# EAGLE design SMDv2 (EAGLE 7.4.0)
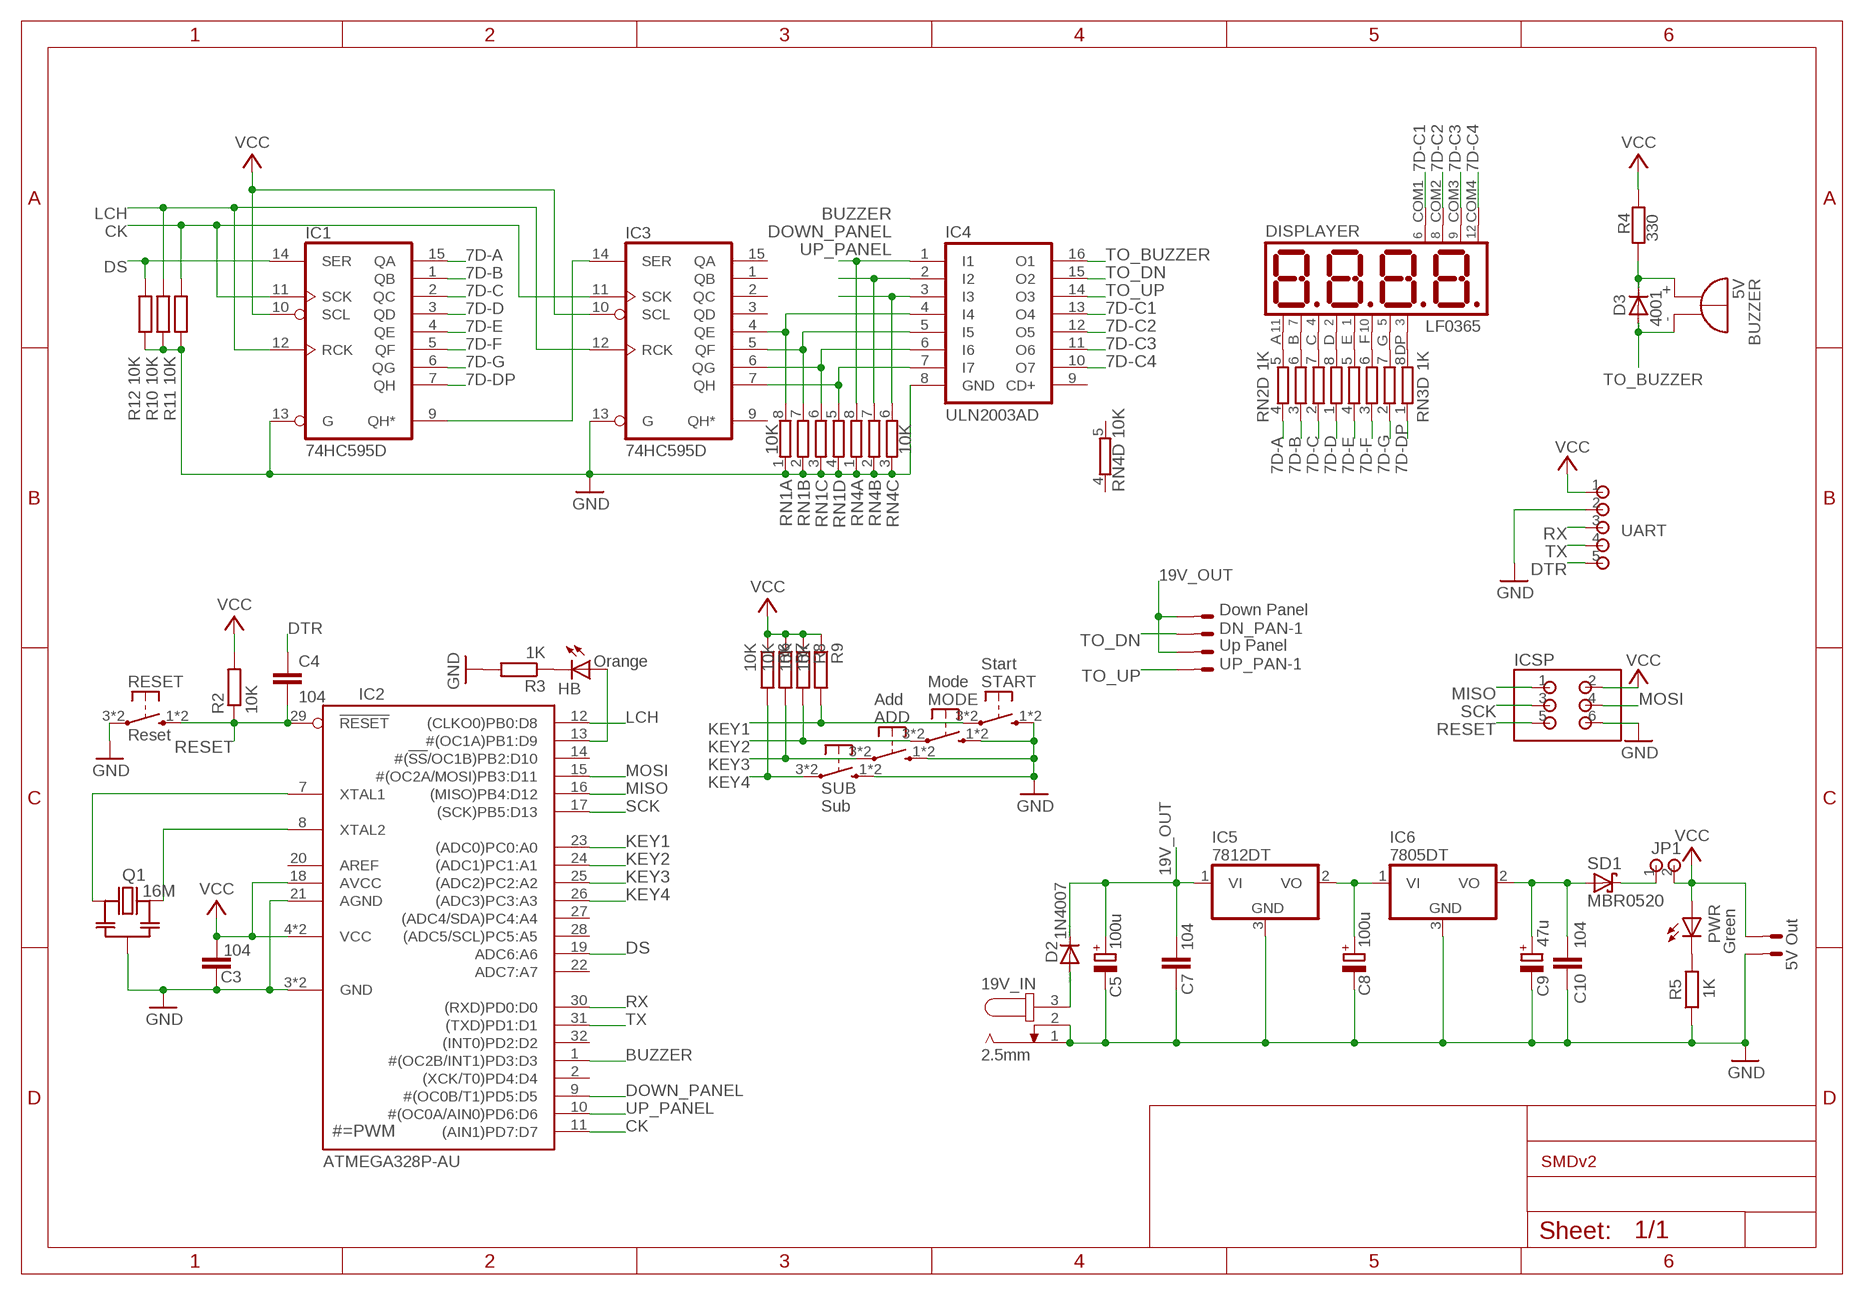
[diagram p0: schematic, sheet 1]

## Parts
5V_OUT  5V Out  L02P  [L02P]
19V_IN  2.5mm  DC-JACK/2.5MM  [SPC4078]
ADD  Add  SW-PUSH/6*6*3.8MM  [SW-6*6*3.8MM]
BUZZER  5V  BZ-5V  [BZ-5V]
C3  104  C-EUC0805  [C0805]
C4  104  C-EUC0805  [C0805]
C5  100u  CPOL-EU140CLH-0810  [140CLH-0810]
C7  104  C-EUC0805  [C0805]
C8  100u  CPOL-EUSMCC  [SMC_C]
C9  47u  CPOL-EUSMCC  [SMC_C]
C10  104  C-EUC0805  [C0805]
D2  1N4007  DIODE-DO-214AC  [DO-214AC]
D3  4001  DIODE-DO-214AC  [DO-214AC]
DISPLAYER  LF0365  [LF036*]
DN_PAN  Down Panel  L02P  [L02P]
HB  Orange  LEDCHIPLED_1206  [CHIPLED_1206]
IC1  74HC595D  [SO16]
IC2  ATMEGA328P-AU  [TQFP32]
IC3  74HC595D  [SO16]
IC4  ULN2003AD  [SO16]
IC5  7812DT  [TO252]
IC6  7805DT  [TO252]
ICSP  PIN-2X3/DIP  [DIP-2.54-2X3]
JP1  PIN-1X2-2.54  [DIP-2.54-1X2]
MODE  Mode  SW-PUSH/6*6*3.8MM  [SW-6*6*3.8MM]
PWR  Green  LEDCHIPLED_1206  [CHIPLED_1206]
Q1  16M  CERMOSCILL-CSTCE  [CSTCE]
R2  10K  R-EU_R0805  [R0805]
R3  1K  R-EU_R0805  [R0805]
R4  330  R-EU_R0805  [R0805]
R5  1K  R-EU_R0805  [R0805]
R6  10K  R-EU_R0805  [R0805]
R7  10K  R-EU_R0805  [R0805]
R8  10K  R-EU_R0805  [R0805]
R9  10K  R-EU_R0805  [R0805]
R10  10K  R-EU_R0805  [R0805]
R11  10K  R-EU_R0805  [R0805]
R12  10K  R-EU_R0805  [R0805]
RESET  Reset  SW-PUSH/4*4*3.8MM  [SW-4*4*3.8MM]
RN1  10K  RN4R-CAY16  [CAY16]
RN2  1K  RN4R-CAY16  [CAY16]
RN3  1K  RN4R-CAY16  [CAY16]
RN4  10K  RN4R-CAY16  [CAY16]
SD1  MBR0520  SCHOTTKY  [SOD123]
START  Start  SW-PUSH/6*6*3.8MM  [SW-6*6*3.8MM]
SUB  Sub  SW-PUSH/6*6*3.8MM  [SW-6*6*3.8MM]
UART  PIN-1X5-2.54  [DIP-2.54-1X5]
UP_PAN  Up Panel  L02P  [L02P]

## Nets
7D-A: IC1.15(QA) RN2.4
7D-B: IC1.1(QB) RN2.3
7D-C: IC1.2(QC) RN2.2
7D-C1: DISPLAYER.COM1 IC4.13(O4)
7D-C2: DISPLAYER.COM2 IC4.12(O5)
7D-C3: DISPLAYER.COM3 IC4.11(O6)
7D-C4: DISPLAYER.COM4 IC4.10(O7)
7D-D: IC1.3(QD) RN2.1
7D-DP: IC1.7(QH) RN3.1
7D-E: IC1.4(QE) RN3.4
7D-F: IC1.5(QF) RN3.3
7D-G: IC1.6(QG) RN3.2
12V: C8.+ IC5.2(VO) IC6.1(VI)
19V_OUT: C5.+ C7.1 D2.C DN_PAN.2 IC5.1(VI) UP_PAN.2
BUZZER: IC2.1(#(OC2B/INT1)PD3:D3) IC4.1(I1) RN4.8
CK: IC1.11(SCK) IC2.11((AIN1)PD7:D7) IC3.11(SCK) R11.2
DOWN_PANEL: IC2.9(#(OC0B/T1)PD5:D5) IC4.2(I2) RN4.7
DS: IC1.14(SER) IC2.19(ADC6:A6) R12.2
DTR: C4.1 UART.5
GND: 5V_OUT.1 19V_IN.1 19V_IN.2 ADD.1(S) ADD.2(S) C3.1 C5.- C7.2 C8.- C9.- C10.2 IC1.13(G) IC2.3(GND) IC2.5(GND) IC2.21(AGND) IC3.13(G) IC4.8(GND) IC5.3(GND) IC6.3(GND) ICSP.6 MODE.1(S) MODE.2(S) Q1.2(GND) R3.2 R5.1 R10.1 R11.1 R12.1 RESET.3(P) RESET.4(P) RN1.1 RN1.2 RN1.3 RN1.4 RN4.1 RN4.2 RN4.3 START.1(S) START.2(S) SUB.1(S) SUB.2(S) UART.2
KEY1: IC2.23((ADC0)PC0:A0) R9.2 START.3(P) START.4(P)
KEY2: IC2.24((ADC1)PC1:A1) MODE.3(P) MODE.4(P) R8.2
KEY3: ADD.3(P) ADD.4(P) IC2.25((ADC2)PC2:A2) R7.2
KEY4: IC2.26((ADC3)PC3:A3) R6.2 SUB.3(P) SUB.4(P)
LCH: IC1.12(RCK) IC2.12((CLKO0)PB0:D8) IC3.12(RCK) R10.2
MISO: IC2.16((MISO)PB4:D12) ICSP.1
MOSI: IC2.15(#(OC2A/MOSI)PB3:D11) ICSP.4
N$1: 19V_IN.3 D2.A
N$3: C9.+ C10.1 IC6.2(VO) SD1.A
N$4: JP1.1 SD1.K
N$5: HB.C R3.1
N$7: DISPLAYER.A RN2.5
N$8: IC3.4(QE) IC4.4(I4) RN1.8
N$9: IC2.7(XTAL1) Q1.1(IN)
N$10: PWR.C R5.2
N$11: IC1.9(QH*) IC3.14(SER)
N$12: IC3.5(QF) IC4.5(I5) RN1.7
N$13: DISPLAYER.B RN2.6
N$14: IC3.6(QG) IC4.6(I6) RN1.6
N$15: IC3.7(QH) IC4.7(I7) RN1.5
N$18: BUZZER.+ D3.C R4.1
N$19: DISPLAYER.C RN2.7
N$20: DISPLAYER.D RN2.8
N$21: DISPLAYER.E RN3.5
N$22: DISPLAYER.F RN3.6
N$23: DISPLAYER.G RN3.7
N$24: DISPLAYER.DP RN3.8
N$28: HB.A IC2.13(#(OC1A)PB1:D9)
N$61: IC2.8(XTAL2) Q1.3(OUT)
RESET: C4.2 IC2.29(!RESET) ICSP.5 R2.1 RESET.1(S) RESET.2(S)
RX: IC2.30((RXD)PD0:D0) UART.3
SCK: IC2.17((SCK)PB5:D13) ICSP.3
TO_BUZZER: BUZZER.- D3.A IC4.16(O1)
TO_DN: DN_PAN.1 IC4.15(O2)
TO_UP: IC4.14(O3) UP_PAN.1
TX: IC2.31((TXD)PD1:D1) UART.4
UP_PANEL: IC2.10(#(OC0A/AIN0)PD6:D6) IC4.3(I3) RN4.6
VCC: 5V_OUT.2 C3.2 IC1.10(SCL) IC2.4(VCC) IC2.6(VCC) IC2.18(AVCC) IC3.10(SCL) ICSP.2 JP1.2 PWR.A R2.2 R4.2 R6.1 R7.1 R8.1 R9.1 UART.1
Unconnected: IC2.2((XCK/T0)PD4:D4) IC2.14(#(!SS!/OC1B)PB2:D10) IC2.20(AREF) IC2.22(ADC7:A7) IC2.27((ADC4/SDA)PC4:A4) IC2.28((ADC5/SCL)PC5:A5) IC2.32((INT0)PD2:D2) IC3.1(QB) IC3.2(QC) IC3.3(QD) IC3.9(QH*) IC3.15(QA) IC4.9(CD+) RN4.4 RN4.5

## Power pins joined to a net without a drawn wire
GND: IC1.8(GND) IC3.8(GND)
VCC: IC1.16(VCC) IC3.16(VCC)

## Library data of the parts
5V_OUT DN_PAN UP_PAN = con-amp-mt:L02P: AMP MT CONNECTOR; OC_FARNELL: unknown; OC_NEWARK: unknown
19V_IN = 0_MyCustom:DC-JACK: DC 電源插座 Power Jack, DC, Right Angle, Through Hole, Rated 5A at 16VDC, PC Terminals Distributor: Farnell (www.Farnell.de) Drawing: 84N1161.pdf / 84N1162.pdf Manufacturer: SPC Technology (www.spctechnology.com) Type: SPC4077(2mm) / SPC 4078(2.5mm)
ADD MODE RESET START SUB = 0_MyCustom:SW-PUSH: 無段式開關
BUZZER = 0_MyCustom:BZ-5V: 5V 直流蜂鳴器 ZEETEK 1205
C3 C4 C7 C10 = rcl:C-EU: CAPACITOR, European symbol
C5 C8 C9 = rcl:CPOL-EU: POLARIZED CAPACITOR, European symbol
D2 D3 = diode:DIODE-: DIODE
DISPLAYER = 0_MyCustom:LF0365: LF0365xWK 共陰
HB PWR = led:LED: LED OSRAM: - CHIPLED LG R971, LG N971, LY N971, LG Q971, LY Q971, LO R971, LY R971 LH N974, LH R974 LS Q976, LO Q976, LY Q976 LO Q996 - Hyper CHIPLED LW Q18S LB Q993, LB Q99A, LB R99A - SideLED LS A670, LO A670, LY A670, LG A670, LP A670 LB A673, LV A673, LT A673, LW A673 LH A674 LY A675 LS A676, LA A676, LO A676, LY A676, LW A676 LS A679, LY A679, LG A679 - Hyper Micro SIDELED® LS Y876, LA Y876, LO Y876, LY Y876 LT Y87S - SmartLED LW L88C, LW L88S LB L89C, LB L89S, LG L890 LS L89K, LO L89K, LY L89K LS L896, LA L896, LO L896, LY L896 - TOPLED LS T670, LO T670, LY T670, LG T670, LP T670 LSG T670, LSP T670, LSY T670, LOP T670, LYG T670 LG T671, LOG T671, LSG T671 LB T673, LV T673, LT T673, LW T673 LH T674 LS T676, LA T676, LO T676, LY T676, LB T676, LH T676, LSB T676, LW T676 LB T67C, LV T67C, LT T67C, LS T67K, LO T67K, LY T67K, LW E67C LS E67B, LA E67B, LO E67B, LY E67B, LB E67C, LV E67C, LT E67C LW T67C LS T679, LY T679, LG T679 LS T770, LO T770, LY T770, LG T770, LP T770 LB T773, LV T773, LT T773, LW T773 LH T774 LS E675, LA E675, LY E675, LS T675 LS T776, LA T776, LO T776, LY T776, LB T776 LHGB T686 LT T68C, LB T68C - Hyper Mini TOPLED® LB M676 - Mini TOPLED Santana® LG M470 LS M47K, LO M47K, LY M47K Source: http://www.osram.convergy.de LUXEON: - LUMILED® LXK2-PW12-R00, LXK2-PW12-S00, LXK2-PW14-U00, LXK2-PW14-V00 LXK2-PM12-R00, LXK2-PM12-S00, LXK2-PM14-U00 LXK2-PE12-Q00, LXK2-PE12-R00, LXK2-PE12-S00, LXK2-PE14-T00, LXK2-PE14-U00 LXK2-PB12-K00, LXK2-PB12-L00, LXK2-PB12-M00, LXK2-PB14-N00, LXK2-PB14-P00, LXK2-PB14-Q00 LXK2-PR12-L00, LXK2-PR12-M00, LXK2-PR14-Q00, LXK2-PR14-R00 LXK2-PD12-Q00, LXK2-PD12-R00, LXK2-PD12-S00 LXK2-PH12-R00, LXK2-PH12-S00 LXK2-PL12-P00, LXK2-PL12-Q00, LXK2-PL12-R00 Source: www.luxeon.com KINGBRIGHT: KA-3528ASYC Source: www.kingbright.com
IC1 IC3 = 74xx-eu:74*595: 8-bit SHIFT REGISTER, output latch
IC2 = 0_MyCustom:ATMEGA328P-AU: ATMEGA328P-AU
IC4 = uln-udn:ULN2003A: DRIVER ARRAY
IC5 IC6 = linear:78*: Positive VOLTAGE REGULATOR Source: http://cache.national.com/ds/LM/LM78L05.pdf http://www.fairchildsemi.com/ds/LM/LM7805.pdf
ICSP = 0_MyCustom:PIN-2X3
JP1 = 0_MyCustom:PIN-1X2
Q1 = 0_MyCustom:CERMOSCILL
R2-R12 = rcl:R-EU_: RESISTOR, European symbol
RN1-RN4 = 0_MyCustom:RN4R: B型排阻 8P4R
SD1 = 0_MyCustom:SCHOTTKY
UART = 0_MyCustom:PIN-1X5

## Net classes
0 default: clearance 0.205 mm

## Board
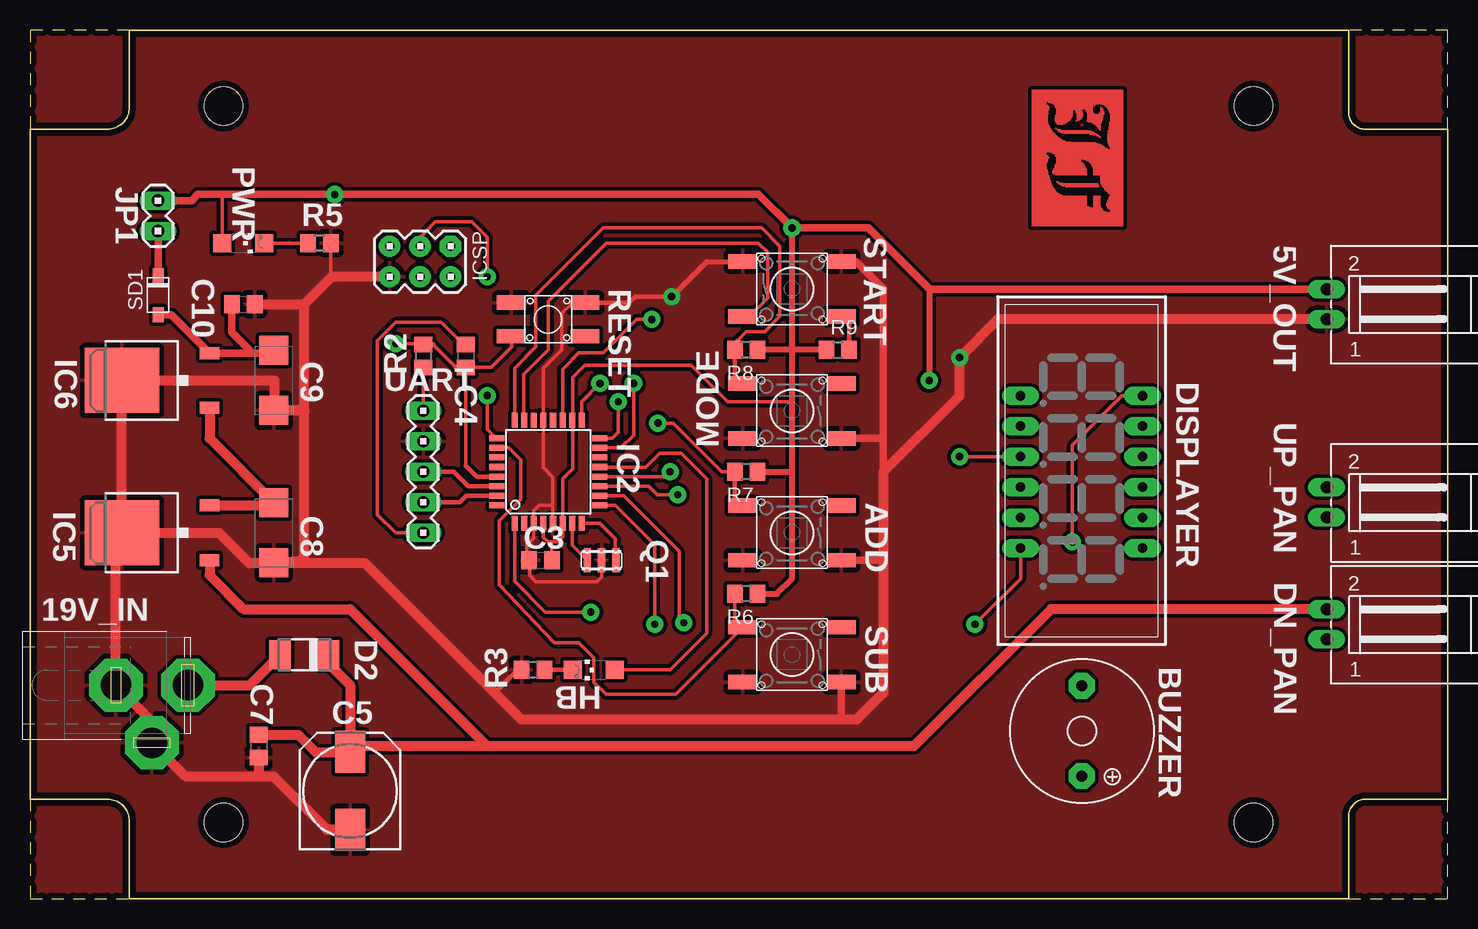
[diagram p1: board, top side]
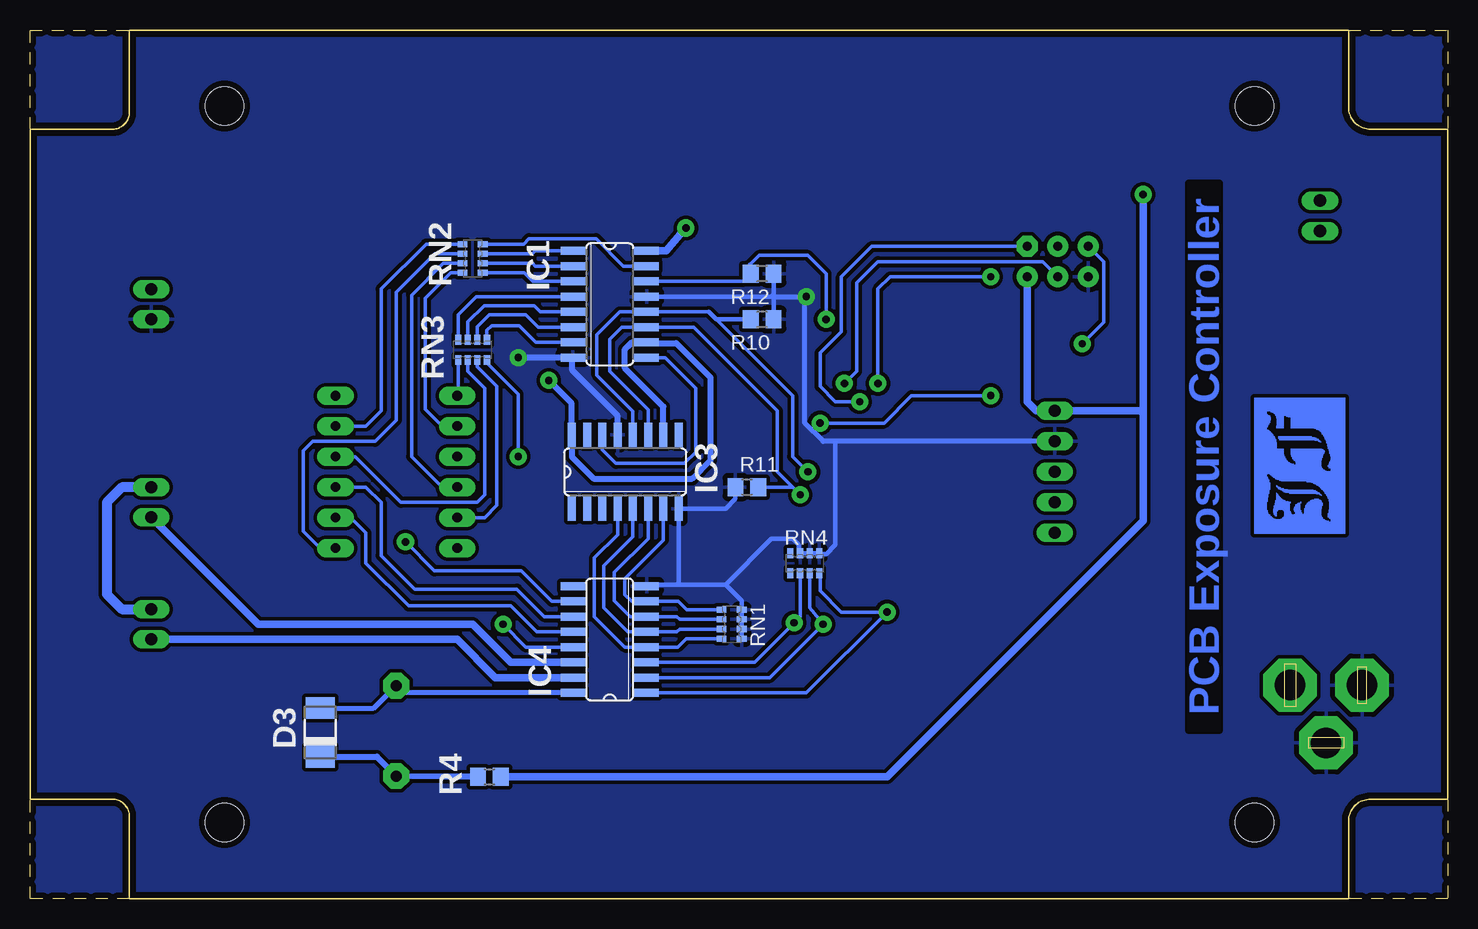
[diagram p2: board, bottom side, seen from below]

Size 118.16 x 72.38 mm. Coordinates in mm from the lower left corner, seen from the top.
Copper layers (1*16): Top 0.035mm / dielectric 1.5mm / Bottom 0.035mm
Design rules "SMD-Orig *": minimum track width 10mil, minimum drill 12mil, track to track 8mil, track to pad 8mil, pad to pad 8mil, via to via 8mil, smd to smd 8mil, copper to edge 20mil, drill to drill 8mil, minimum pad ring 10mil, minimum via ring 8mil, stop-mask expansion 4mil, vias tented up to drill 0mil, thermal gap 16mil
tKeepout: area 81.7,8 to 93.6,19.9; area 89.5,10.1 to 90.9,11.5; 157 lines
bKeepout: 59 lines

### Footprints (pad centres in the part's own frame; a part is rotated, then mirrored left to right if it is on the bottom)
L02P = drill 1.016 long: 1 1.25,-6.25; 2 -1.25,-6.25
SPC4078 = drill 2.54 pad 4.445 octagon: 1 -3,0; 2 0,-4.8; 3 3,0
SW-6*6*3.8MM = smd 2.4 x 1.2: 1 -4.109,2.286; 2 4.109,2.286; 3 -4.109,-2.286; 4 4.109,-2.286
BZ-5V = drill 0.914 pad 2.159 octagon: + 3.759,0; - -3.759,0
C0805 = smd 1.3 x 1.5: 1 -0.95,0; 2 0.95,0
140CLH-0810 = smd 3.5 x 2.5: + 3.25,0; - -3.25,0
SMC_C = smd 2.4 x 2.4: + -2.5,0; - 2.5,0
DO-214AC = smd 1.8 x 2.4: A 2.025,0; C -2.025,0
LF036* = drill 0.813 pad 1.524 long: A -3.175,5.08; B 6.985,5.08; C 1.905,-5.08; COM1 6.985,-5.08; COM2 4.445,5.08; COM3 1.905,5.08; COM4 -5.715,5.08; D -3.175,-5.08; DP -0.635,-5.08; E -5.715,-5.08; F -0.635,5.08; G 4.445,-5.08
CHIPLED_1206 = smd 1.5 x 1.5: A 0,-1.75; C 0,1.75
SO16 = smd 0.66 x 2.032: 1 -4.445,-3.073; 2 -3.175,-3.073; 3 -1.905,-3.073; 4 -0.635,-3.073; 5 0.635,-3.073; 6 1.905,-3.073; 7 3.175,-3.073; 8 4.445,-3.073; 9 4.445,3.073; 10 3.175,3.073; 11 1.905,3.073; 12 0.635,3.073; 13 -0.635,3.073; 14 -1.905,3.073; 15 -3.175,3.073; 16 -4.445,3.073
TQFP32 = smd 1.27 x 0.508: 1 -4.293,2.8; 2 -4.293,2; 3 -4.293,1.2; 4 -4.293,0.4; 5 -4.293,-0.4; 6 -4.293,-1.2; 7 -4.293,-2; 8 -4.293,-2.8; 17 4.293,-2.8; 18 4.293,-2; 19 4.293,-1.2; 20 4.293,-0.4; 21 4.293,0.4; 22 4.293,1.2; 23 4.293,2; 24 4.293,2.8 | smd 0.508 x 1.27: 9 -2.8,-4.293; 10 -2,-4.293; 11 -1.2,-4.293; 12 -0.4,-4.293; 13 0.4,-4.293; 14 1.2,-4.293; 15 2,-4.293; 16 2.8,-4.293; 25 2.8,4.293; 26 2,4.293; 27 1.2,4.293; 28 0.4,4.293; 29 -0.4,4.293; 30 -1.2,4.293; 31 -2,4.293; 32 -2.8,4.293
TO252 = smd 1 x 1.6: 1 -2.28,-4.8; 2 2.28,-4.8 | smd 5.4 x 6.2: 3 0,2.5
DIP-2.54-2X3 = drill 0.762 pad 1.778 octagon: 1 -1.27,2.54 | drill 0.762 pad 1.778: 2 1.27,2.54; 3 -1.27,0; 4 1.27,0; 5 -1.27,-2.54; 6 1.27,-2.54
DIP-2.54-1X2 = drill 1.016 long: 1 -1.27,0; 2 1.27,0
CSTCE = smd 0.6 x 2: 1 -1.2,0; 2 0,0; 3 1.2,0
R0805 = smd 1.3 x 1.5: 1 -0.95,0; 2 0.95,0
SW-4*4*3.8MM = smd 2.4 x 1.2: 1 -3.076,1.4; 2 3.076,1.4; 3 3.076,-1.4; 4 -3.076,-1.4
CAY16 = smd 0.508 x 0.813: 1 -1.2,-0.838; 2 -0.4,-0.838; 3 0.4,-0.838; 4 1.2,-0.838; 5 1.2,0.838; 6 0.4,0.838; 7 -0.4,0.838; 8 -1.2,0.838
SOD123 = smd 1.219 x 0.914: A -1.638,0; K 1.638,0
CASE-1 = hole 3.2: 16.129,6.35; 101.956,6.35; 101.956,66.03; 16.129,66.03
DIP-2.54-1X5 = drill 1.016 long: 1 -5.08,0; 2 -2.54,0; 3 0,0; 4 2.54,0; 5 5.08,0

### Placement (x,y rotation side)
5V_OUT  114.3,49.53 270 top
19V_IN  10.16,17.78 0 top
ADD  63.5,30.48 180 top
BUZZER  87.66,13.97 270 top
C3  42.55,28.19 0 top
C4  36.32,45.21 270 top
C5  26.67,8.98 90 top
C7  19.05,12.7 270 top
C8  20.32,30.48 270 top
C9  20.32,43.18 270 top
C10  17.78,49.53 0 top
D2  22.86,20.32 180 top
D3  93.98,13.84 90 bottom
DISPLAYER  87.63,36.2 270 top
DN_PAN  114.3,22.86 270 top
HB  46.99,19.05 90 top
IC1  69.85,49.53 270 bottom
IC2  43.18,35.56 90 top
IC3  68.55,35.56 0 bottom
IC4  69.85,21.59 90 bottom
IC5  10.16,30.48 90 top
IC6  10.16,43.18 90 top
ICSP  32.51,53.09 270 top
JP1  10.67,56.9 90 top
MODE  63.5,40.64 180 top
PWR  17.78,54.61 270 top
Q1  47.62,28.19 0 top
R2  32.77,45.21 270 top
R3  41.91,19.05 180 top
R4  79.88,10.16 0 bottom
R5  24.13,54.61 180 top
R6  59.69,25.4 180 top
R7  59.69,35.56 180 top
R8  59.69,45.72 180 top
R9  67.31,45.72 0 top
R10  57.15,48.26 180 bottom
R11  58.42,34.29 0 bottom
R12  57.15,52.07 180 bottom
RESET  43.18,48.26 180 top
RN1  59.69,22.86 90 bottom
RN2  81.28,53.34 90 bottom
RN3  81.28,45.72 180 bottom
RN4  53.59,27.94 180 bottom
SD1  10.67,50.29 90 top
START  63.5,50.8 0 top
SUB  63.5,20.32 180 top
U$1  [CASE-1]  0,0 0 top
UART  32.77,35.56 270 top
UP_PAN  114.3,33.02 270 top

### Tracks (layer width: path | path; a pad name or v marks a point on that pad's centre or on a via)
7D-A
  Bottom 0.305: RN2.4 77.03,54.54 76.58,54.99 70.99,54.99 68.71,52.7 IC1.15
7D-B
  Bottom 0.305: RN2.3 76.31,53.74 76.07,53.98 IC1.1
7D-C
  Bottom 0.305: RN2.2 76.28,52.94 76.07,52.7 IC1.2
7D-C1  (via drill 0.61 pad 1.42)
  Top 0.305: DISPLAYER.COM1 82.55,26.67 v78.74,22.86
  Bottom 0.305: IC4.13 76.83,20.95 v78.74,22.86
7D-C2
  Bottom 0.305: DISPLAYER.COM2 91.44,31.75 90.17,30.48 90.17,27.94 86.61,24.38 78.11,24.38 75.95,22.23 IC4.12
7D-C3
  Bottom 0.305: DISPLAYER.COM3 90.17,34.29 88.9,33.02 88.9,28.57 86.11,25.78 77.6,25.78 75.31,23.5 IC4.11
7D-C4  (via drill 0.61 pad 1.42)
  Top 0.305: v86.87,29.72 86.87,37.78 91,41.91 DISPLAYER.COM4
  Bottom 0.305: IC4.10 74.68,24.77 77.22,27.3 84.45,27.3 v86.87,29.72
7D-D
  Bottom 0.305: RN2.1 76.96,52.14 76.26,51.44 IC1.3
7D-DP
  Bottom 0.305: RN3.1 80.08,47.36 79.69,47.75 77.41,47.75 76.01,46.35 IC1.7
7D-E
  Bottom 0.305: RN3.4 82.48,48.65 80.96,50.16 IC1.4
7D-F
  Bottom 0.305: RN3.3 81.68,48.05 80.33,49.4 76.14,49.4 75.63,48.9 IC1.5
7D-G
  Bottom 0.305: RN3.2 80.88,47.64 79.88,48.64 76.83,48.64 75.82,47.62 IC1.6
12V
  Top 0.508: 20.1,32.76 C8.+
  Top 0.813: IC5.2 20.1,32.76 | IC6.1 14.96,38.34 C8.+
19V_OUT
  Top 0.61: 108.03,24.13 DN_PAN.2
  Top 0.813: IC5.1 14.96,26.95 17.78,24.13 26.67,24.13 38.1,12.7 | 26.76,12.14 C5.+ | D2.C 24.89,19.57 26.67,17.78 26.67,12.7 | 26.67,12.7 C5.+ | C7.1 22.36,13.65 23.81,12.19 26.64,12.19 C5.+ | 108.03,24.13 85.09,24.13 73.66,12.7 38.1,12.7 | 38.1,12.7 26.67,12.7
  Bottom 0.813: UP_PAN.2 110.51,34.27 111.76,33.02 111.76,25.36 110.51,24.11 DN_PAN.2
BUZZER  (via drill 0.61 pad 1.42)
  Top 0.305: 40.35,31.24 IC2.1 40.38,26.42 42.93,23.88 v46.74,23.88
  Bottom 0.305: IC4.1 53.47,17.14 v46.74,23.88 50.55,23.88 52.32,25.65 52.32,27.03 RN4.8
CK  (via drill 0.61 pad 1.42)
  Top 0.305: v53.98,33.66 52.26,33.66 51.56,34.36 IC2.11
  Bottom 0.305: IC3.11 66.65,40.74 69.85,43.94 69.85,46.61 68.83,47.62 IC1.11 62.87,47.62 55.88,40.64 55.88,35.56 v53.98,33.66 54.61,34.29 R11.2
DOWN_PANEL  (via drill 0.61 pad 1.42)
  Top 0.305: v52.07,22.86 52.07,29.46 48.77,32.77 IC2.9
  Bottom 0.305: RN4.7 53.19,24.24 v52.07,22.86 56.52,18.41 IC4.2
DS  (via drill 0.61 pad 1.42)
  Top 0.305: IC2.19 44.38,44.13 45.72,45.47 47.75,45.47 50.55,48.26 v51.82,48.26
  Bottom 0.305: IC1.14 58.73,51.44 R12.2 | v51.82,48.26 51.82,52.07 53.34,53.59 57.4,53.59 58.17,52.83
  Bottom 0.356: 58.17,52.83 58.17,52.14 R12.2
DTR
  Top 0.305: C4.1 36.13,46.16 34.29,48.01 30.48,48.01 28.96,46.48 28.96,32 30.48,30.48 UART.5
GND  (via drill 0.61 pad 1.42)
  Top 0.305: 45.21,49.66 44.32,48.77 44.32,45.72 42.78,44.18 IC2.21 42.78,35.92 43.58,35.12 IC2.5 | 43.43,32.77 42.42,32.77 41.98,32.33 IC2.3 41.98,30.04 41.4,29.46 41.4,28.25 C3.1 41.66,28.13 41.66,26.92 42.16,26.42 47.24,26.42 47.62,26.8 Q1.2 | R5.1 25.08,52.14 25.4,51.82
  Top 0.356: R3.2 40.64,19.05 38.73,17.14 | IC5.3 9.91,30.48 | RESET.4 49.91,49.66 50.42,50.16 v53.47,50.16
  Top 0.406: 27.96,27.96 27.94,27.94 | 45.21,49.66 RESET.4 | IC2.3 | 46.86,15.05 46.99,14.92 | v53.47,50.16 56.39,53.09 START.1
  Top 0.508: RESET.3 40.26,49.66 | 20.32,40.64 C9.- | C8.- 20.36,27.98 | 7.62,30.44 IC5.3
  Top 0.61: 6.67,42.19 IC6.3 | SUB.1 67.61,15.22 67.31,14.92 | START.2 68.83,53.09 71.12,50.8 71.12,38.1 | 71.12,38.1 71.12,35.56 | MODE.1 70.87,38.35 71.12,38.1 | ADD.1 70.87,28.19 71.12,27.94
  Top 0.813: IC5.3 IC6.3 20.36,43.18 C9.- 22.86,40.68 | 22.86,40.64 20.32,40.64 | 20.36,27.98 22.86,28.19 22.86,40.64 | 7.62,30.44 7.62,30.48 7.16,30.02 19V_IN.1 10.16,14.78 19V_IN.2 12.98,10.16 19.05,10.16 | C5.- 24.77,5.71 20.32,10.16 19.05,10.16 | C7.2 19.05,10.16 | 8.89,30.48 9.91,30.48 15.75,30.48 18.29,27.94 27.94,27.94 38.73,17.14 40.96,14.92 46.99,14.92 67.31,14.92 68.9,14.92 71.12,17.14 71.12,27.94 71.12,35.56 77.47,41.91 v77.47,45.09 80.67,48.28 5V_OUT.1 | C10.2 22.86,49.53 | 22.86,40.64 22.86,40.68 | 22.86,40.68 22.86,49.53 | ICSP.6 25.4,51.82 25.15,51.82 22.86,49.53
  Bottom 0.305: 66.65,26.16 IC4.8
  Bottom 0.356: R11.1 59.37,33.31 60.2,32.49 IC3.8 64.11,26.31 64.26,26.16 | 66.65,26.16 64.26,26.16 | 64.26,26.16 60.2,26.16 | 51.05,38.1 51.05,29.46 51.82,28.7 52.32,28.7 52.32,28.71 RN4.1 RN4.2 RN4.3 54.1,28.89 54.1,29.46 54.61,29.97 56.39,29.97 60.2,26.16 | RN1.1 RN1.2 RN1.3 RN1.4 58.85,24.82 60.2,26.16 | IC1.13 56.39,50.16 | 56.39,50.16 56.13,50.16 56.2,50.1 R10.1 | R12.1 56.2,50.35 56.39,50.16
  Bottom 0.406: UART.2 51.05,38.1 52.07,38.1 53.59,39.62 53.59,50.04 v53.47,50.16 56.13,50.16
  Bottom 0.508: v77.47,45.09 IC1.8 72.96,45.05 72.96,44.01 69.19,40.23 IC3.13
  pour Top (isolate 0.305): 0,0 118.11,0 118.11,72.39 0,72.39
  pour Bottom (isolate 0.305): 0,0 118.11,0 118.11,72.39 0,72.39
KEY1
  Top 0.305: 59.94,48.51 61.47,50.04 61.47,53.85 60.71,54.61 48.01,54.61 43.18,49.78 43.18,45.72 41.15,43.69 41.15,39.88
  Top 0.356: START.3 59.94,48.51 | 41.15,39.88 IC2.23 | R9.2 68.26,47.86 START.4
KEY2
  Top 0.305: IC2.24 40.38,44.19 42.16,45.97 42.16,50.29 47.75,55.88 60.96,55.88 62.48,54.36 62.48,48.51 61.21,47.24 59.69,47.24 58.93,46.48
  Top 0.356: 58.93,46.48 58.93,45.91 R8.2 58.74,43.58 MODE.4
KEY3  (via drill 0.61 pad 1.42)
  Top 0.305: R7.2 57.66,35.56 53.59,39.62 v52.32,39.62 | v38.1,41.91 38.1,39.12 38.83,38.38
  Top 0.356: R7.2 58.74,33.42 ADD.4 | 38.83,38.38 38.86,38.38 IC2.25
  Bottom 0.305: v52.32,39.62 46.99,39.62 44.7,41.91 v38.1,41.91
KEY4
  Top 0.305: R6.2 58.74,23.26 | IC2.26 39.91,37.56 40.89,36.58 40.89,33.27 39.12,31.5 39.12,26.16 43.69,21.34 45.72,21.34 46.99,20.07 46.99,18.03 48.01,17.02 53.8,17.02 SUB.4
  Top 0.356: 58.74,23.26 SUB.4
LCH  (via drill 0.61 pad 1.42)
  Top 0.305: IC2.12 52.94,35.16 v53.34,35.56
  Bottom 0.305: 61.59,48.9 IC1.12 69.03,48.9 70.93,46.99 70.93,43.62 67.92,40.62 IC3.12 | 60.96,48.26 54.61,41.91 54.61,36.83 v53.34,35.56
  Bottom 0.356: R10.2 60.96,48.26 61.59,48.9
MISO  (via drill 0.61 pad 1.42)
  Top 0.305: 47.5,38.35 48.51,38.35 49.02,38.86 v49.02,41.4
  Top 0.356: IC2.16 47.49,38.36 47.5,38.35
  Bottom 0.305: v49.02,41.4 51.05,41.4 52.32,42.67 52.32,45.47 50.55,47.24 50.55,51.82 48.01,54.36 ICSP.1
MOSI  (via drill 0.61 pad 1.42)
  Top 0.305: IC2.15 49.24,37.56 50.29,38.61 v50.29,42.93
  Bottom 0.305: v50.29,42.93 49.28,43.94 49.28,51.31 47.5,53.09 33.78,53.09 ICSP.4
N$1
  Top 0.813: 19V_IN.3 18.3,17.78 D2.A
N$3
  Top 0.406: C10.1 16.76,49.53 16.76,49.02
  Top 0.508: 20.1,45.46 C9.+
  Top 0.61: 18.54,45.46 IC6.2 11.77,48.65 SD1.A | 18.54,45.46 20.1,45.46 | C10.1 16.83,47.17 18.54,45.46
N$4
  Top 0.61: SD1.K JP1.1
N$5
  Top 0.356: HB.C R3.1
N$7
  Bottom 0.305: RN2.5 85.16,54.54 88.9,50.8 88.9,40.64 90.17,39.37 DISPLAYER.A
N$8
  Bottom 0.305: IC3.4 69.19,30.33 71.12,28.38 71.12,23.5 68.58,20.95 IC4.4 64.2,20.95 63.49,21.66 RN1.8
N$9
  Top 0.305: IC2.7 45.18,29.44 Q1.1
N$10
  Top 0.305: PWR.C R5.2
N$11
  Bottom 0.305: IC1.9 65.22,45.09 62.67,42.55 62.67,37.21 63.63,36.26 69.34,36.26 70.48,37.4 70.48,38.61 IC3.14
N$12
  Bottom 0.305: IC3.5 67.92,30.16 70.36,27.72 70.36,24.23 68.35,22.23 IC4.5 64.26,22.23 64.03,22.46 RN1.7
N$13
  Bottom 0.305: RN2.6 84.44,53.74 87.63,50.55 87.63,39.88 89.41,38.1 94.61,38.1 95.38,37.34 95.38,30.61 93.98,29.21 DISPLAYER.B
N$14
  Bottom 0.305: IC3.6 66.65,30 69.47,27.18 69.47,24.83 68.14,23.5 IC4.6 64.26,23.5 64.03,23.26 RN1.6
N$15
  Bottom 0.305: IC3.7 65.38,29.87 68.58,26.67 68.58,25.34 68.01,24.77 IC4.7 64.14,24.77 63.43,24.06 RN1.5
N$18
  Bottom 0.508: R4.1 83.9,10.16 BUZZER.+ 89.26,11.82 D3.C
N$19
  Bottom 0.305: RN2.7 83.71,52.94 86.36,50.29 86.36,36.83 83.82,34.29 DISPLAYER.C
N$20
  Bottom 0.305: RN2.8 83.11,52.14 85.22,50.04 85.22,40.77 83.82,39.37 DISPLAYER.D
N$21
  Bottom 0.305: RN3.5 82.48,41.98 DISPLAYER.E
N$22
  Bottom 0.305: RN3.6 81.68,43.96 80.26,42.55 80.26,33.66 80.9,33.02 87.25,33.02 91.06,36.83 DISPLAYER.F
N$23
  Bottom 0.305: RN3.7 80.88,44.3 79.25,42.67 79.25,32.77 80.26,31.75 DISPLAYER.G
N$24  (via drill 0.61 pad 1.42)
  Top 0.305: v77.47,36.83 DISPLAYER.DP
  Bottom 0.305: RN3.8 80.08,44.65 77.48,42.04 v77.48,36.84 v77.47,36.83
N$28
  Top 0.305: IC2.13 51.31,35.96 52.47,37.1 54.27,37.1 56.39,34.99 56.39,22.1 53.34,19.05 HB.A
N$61
  Top 0.305: IC2.8 47.47,31.27 48.77,29.97 48.77,28.25 Q1.3
RESET  (via drill 0.61 pad 1.42)
  Top 0.305: 36.32,36.07 C4.2 38.42,44.26 40.13,45.97 40.13,46.83 | 35.49,44.26 33.59,46.16 | v30.48,46.23 32.7,46.23 R2.1
  Top 0.356: IC2.29 37.23,35.16 36.32,36.07
  Top 0.406: R2.1 33.59,46.16 | C4.2 35.49,44.26 | 40.13,46.83 RESET.2
  Bottom 0.305: ICSP.5 28.7,53.09 28.7,48.01 v30.48,46.23
RX
  Top 0.356: IC2.30 36.51,34.36 35.31,35.56 UART.3
SCK  (via drill 0.61 pad 1.42)
  Top 0.305: IC2.17 45.98,41.41 v47.5,42.93 | v38.1,51.82 38.1,55.12 36.83,56.39 33.78,56.39 32.51,55.12 ICSP.3
  Bottom 0.305: v47.5,42.93 47.5,50.8 46.48,51.82 v38.1,51.82
TO_BUZZER
  Bottom 0.406: D3.A 89.52,15.87 BUZZER.- 87.1,17.14 IC4.16
TO_DN
  Bottom 0.508: 108.03,21.59 DN_PAN.1
  Bottom 0.61: IC4.15 79.38,18.41 82.55,21.59 108.03,21.59
TO_UP
  Bottom 0.61: IC4.14 78.11,19.68 81.28,22.86 99.14,22.86 UP_PAN.1
TX
  Top 0.356: IC2.31 36.35,33.56 35.81,33.02 UART.4
UP_PANEL  (via drill 0.61 pad 1.42)
  Top 0.305: IC2.10 49.5,33.56 54.1,28.96 54.1,23.37 v54.48,22.99
  Bottom 0.305: IC4.3 57.78,19.68 v54.48,22.99 53.99,23.48 RN4.6
VCC  (via drill 0.61 pad 1.42)
  Top 0.305: IC2.18 45.21,39.82 45.21,35.81 44.38,34.98 IC2.6 44.38,30.16 43.94,29.72 43.18,29.72 | IC2.4 42.78,30.12 43.18,29.72 | C3.2 43.49,29.66 43.18,29.72 | UART.1 R2.2 | 45.21,39.88 45.21,43.43 46.23,44.45 55.12,44.45 58.17,41.4 63.5,41.4 | PWR.A 16.03,58.65 16,58.67
  Top 0.356: IC2.18 45.21,39.88
  Top 0.508: R9.1 63.5,45.72 | 63.5,45.72 R8.1 | 63.5,45.72 v63.5,55.88 | 74.93,50.8 v74.93,43.18 | R6.1 62.23,25.4 63.5,26.67 63.5,35.56 | 63.5,35.56 63.5,41.4 63.5,45.72 | R7.1 63.5,35.56
  Top 0.61: 5V_OUT.2 74.95,50.78 74.93,50.8 69.85,55.88 v63.5,55.88 60.71,58.67 v25.4,58.67 16,58.67 13.97,58.67 13.46,58.17 JP1.2
  Bottom 0.508: IC3.10 65.38,41 68.58,44.2 68.58,45.72 | 68.58,45.72 68.58,45.78 68.01,46.35 IC1.10 | 68.58,45.72 68.01,46.29 64.33,46.29 61.47,43.43 61.47,36.51 62.99,34.99 71.18,34.99 73,36.8 IC3.16 73,38.57 73.03,38.54 73.03,41.27 v74.93,43.18
  Bottom 0.61: R4.2 46.74,10.16 25.4,31.5 25.4,40.39 | IC1.16 65.15,53.98 v63.5,55.88 | 25.4,40.39 25.65,40.64 UART.1 34.29,40.64 35.05,41.4 ICSP.2 | 25.4,40.39 v25.4,58.67
(copper drawn outside any net)
  shapes: Bottom area x453, Top area x453

### Text on the board
Bottom: PCB Exposure Controller
tKeepout: GND | RXD | TXD | DTR | VCC